# EAGLE schematic bt_remote_controller (EAGLE 6.5.0)
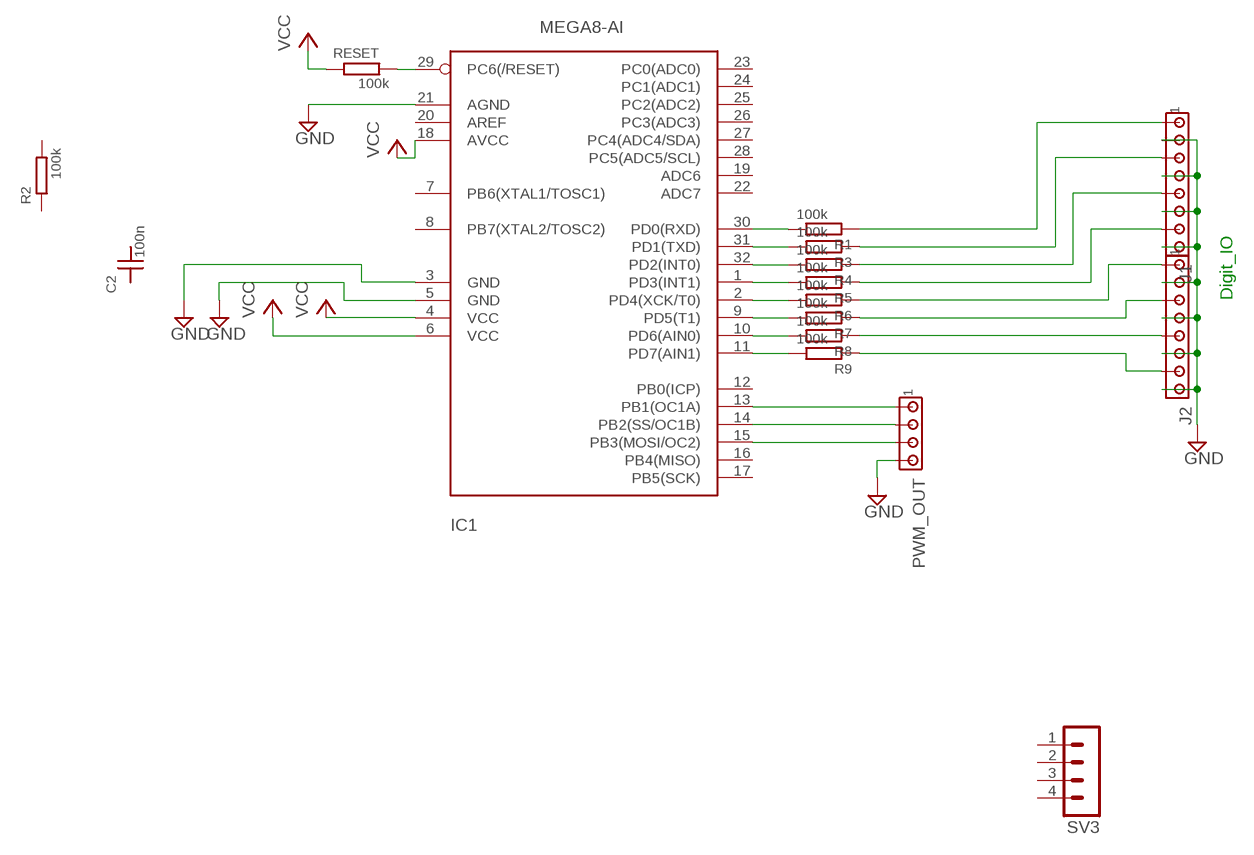
[diagram p0: schematic, sheet 1]

## Parts
C2  100n  C  [1206]
IC1  MEGA8-AI  [TQFP32-08]
J1  MTA08-100  [10X08MTA]
J2  MTA08-100  [10X08MTA]
PWM_OUT  MTA04-156  [1X4MTA]
R1  100k  R  [1206]
R2  100k  R  [1206]
R3  100k  R  [1206]
R4  100k  R  [1206]
R5  100k  R  [1206]
R6  100k  R  [1206]
R7  100k  R  [1206]
R8  100k  R  [1206]
R9  100k  R  [1206]
RESET  100k  R  [1206]
SV3  MA04-1  [MA04-1]

## Nets
GND: IC1.3(GND) IC1.5(GND) IC1.21(AGND) J1.2 J1.4 J1.6 J1.8 J2.2 J2.4 J2.6 J2.8 PWM_OUT.4
N$1: J1.1 R1.PIN
N$2: IC1.13(PB1(OC1A)) PWM_OUT.1
N$3: IC1.14(PB2(SS/OC1B)) PWM_OUT.2
N$4: IC1.15(PB3(MOSI/OC2)) PWM_OUT.3
N$5: J1.3 R3.PIN
N$6: J1.5 R4.PIN
N$7: J1.7 R5.PIN
N$8: J2.1 R6.PIN
N$9: J2.3 R7.PIN
N$10: IC1.30(PD0(RXD)) R1.PIN+
N$11: J2.7 R9.PIN
N$12: IC1.31(PD1(TXD)) R3.PIN+
N$13: IC1.32(PD2(INT0)) R4.PIN+
N$14: IC1.1(PD3(INT1)) R5.PIN+
N$15: IC1.2(PD4(XCK/T0)) R6.PIN+
N$16: IC1.9(PD5(T1)) R7.PIN+
N$17: IC1.10(PD6(AIN0)) R8.PIN+
N$18: IC1.11(PD7(AIN1)) R9.PIN+
N$19: IC1.29(PC6(/RESET)) RESET.PIN+
N$20: J2.5 R8.PIN
VCC: IC1.4(VCC) IC1.6(VCC) IC1.18(AVCC) RESET.PIN
Unconnected: C2.PIN C2.PIN+ IC1.7(PB6(XTAL1/TOSC1)) IC1.8(PB7(XTAL2/TOSC2)) IC1.12(PB0(ICP)) IC1.16(PB4(MISO)) IC1.17(PB5(SCK)) IC1.19(ADC6) IC1.20(AREF) IC1.22(ADC7) IC1.23(PC0(ADC0)) IC1.24(PC1(ADC1)) IC1.25(PC2(ADC2)) IC1.26(PC3(ADC3)) IC1.27(PC4(ADC4/SDA)) IC1.28(PC5(ADC5/SCL)) R2.PIN R2.PIN+ SV3.1 SV3.2 SV3.3 SV3.4

## Notes on the sheet
- Digit_IO

## Library data of the parts
C2 = USBEXPLORER:C
IC1 = avr-1:MEGA8: MICROCONTROLLER 8 Kbytes FLASH 1 kbytes SRAM 512 bytes EEPROM USART 6-channel 10 bit ADC 2-channel 8 bit ADC
J1 J2 = con-amp:MTA08-100: AMP connector
PWM_OUT = con-amp:MTA04-156: AMP connector
R1-R9 RESET = USBEXPLORER:R
SV3 = con-lstb:MA04-1: PIN HEADER; OC_FARNELL: unknown; OC_NEWARK: unknown